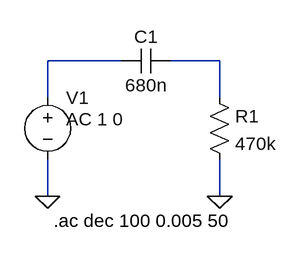
[diagram p0: schematic high_pass_filter.asc]
high_pass_filter.asc, the LTspice schematic file:
Version 4
SHEET 1 880 680
WIRE 144 160 48 160
WIRE 272 160 208 160
WIRE 48 208 48 160
WIRE 272 208 272 160
WIRE 48 336 48 288
WIRE 272 336 272 288
FLAG 272 336 0
FLAG 48 336 0
SYMBOL voltage 48 192 R0
WINDOW 123 24 44 Left 2
WINDOW 39 0 0 Left 0
SYMATTR InstName V1
SYMATTR Value ""
SYMATTR Value2 AC 1 0
SYMBOL cap 208 144 R90
WINDOW 0 0 32 VBottom 2
WINDOW 3 32 32 VTop 2
SYMATTR InstName C1
SYMATTR Value 680n
SYMBOL res 256 192 R0
SYMATTR InstName R1
SYMATTR Value 470k
TEXT 56 368 Left 2 !.ac dec 100 0.005 50

The netlist it stands for:
* high_pass_filter.asc
V1 N001 0 AC 1 0
C1 N002 N001 680n
R1 N002 0 470k
.ac dec 100 0.005 50
.backanno
.end